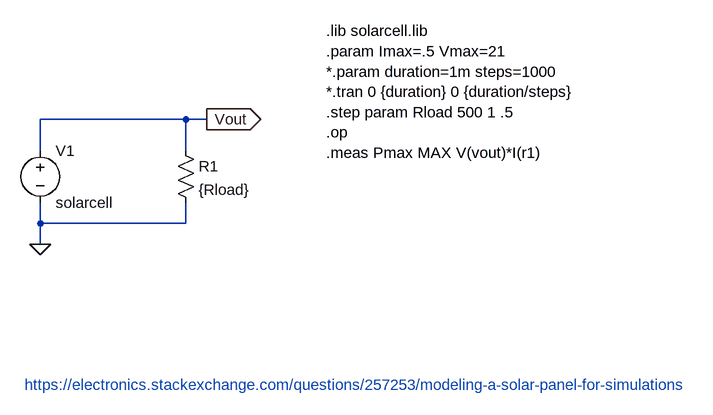
[diagram p0: schematic test.asc]
test.asc, the LTspice schematic file:
Version 4
SHEET 1 1156 680
WIRE 352 224 128 224
WIRE 384 224 352 224
WIRE 128 272 128 224
WIRE 352 272 352 224
WIRE 128 384 128 352
WIRE 352 384 352 352
WIRE 352 384 128 384
WIRE 128 416 128 384
FLAG 128 416 0
FLAG 384 224 Vout
IOPIN 384 224 Out
SYMBOL Res 336 256 R0
SYMATTR InstName R1
SYMATTR Value {Rload}
SYMBOL Voltage 128 256 R0
SYMATTR InstName V1
SYMATTR Value solarcell
SYMATTR Prefix X
SYMATTR SpiceLine Imax={Imax}, Vmax={Vmax}
TEXT 568 88 Left 2 !.lib solarcell.lib\n.param Imax=.5 Vmax=21\n*.param duration=1m steps=1000\n*.tran 0 {duration} 0 {duration/steps}\n.step param Rload 500 1 .5\n.op\n.meas Pmax MAX V(vout)*I(r1)
TEXT 104 632 Left 2 ;https://electronics.stackexchange.com/questions/257253/modeling-a-solar-panel-for-simulations

The netlist it stands for:
* test.asc
R1 Vout 0 {Rload}
XV1 Vout 0 solarcell Imax={Imax}, Vmax={Vmax}  ; pins + -
.lib solarcell.lib
.param Imax=.5 Vmax=21
*.param duration=1m steps=1000
*.tran 0 {duration} 0 {duration/steps}
.step param Rload 500 1 .5
.op
.meas Pmax MAX V(vout)*I(r1)
* https://electronics.stackexchange.com/questions/257253/modeling-a-solar-panel-for-simulations
.backanno
.end